# Altium schematic sheet USBConn.SchDoc
size A4; SheetNumber: 9; SheetTotal: 9
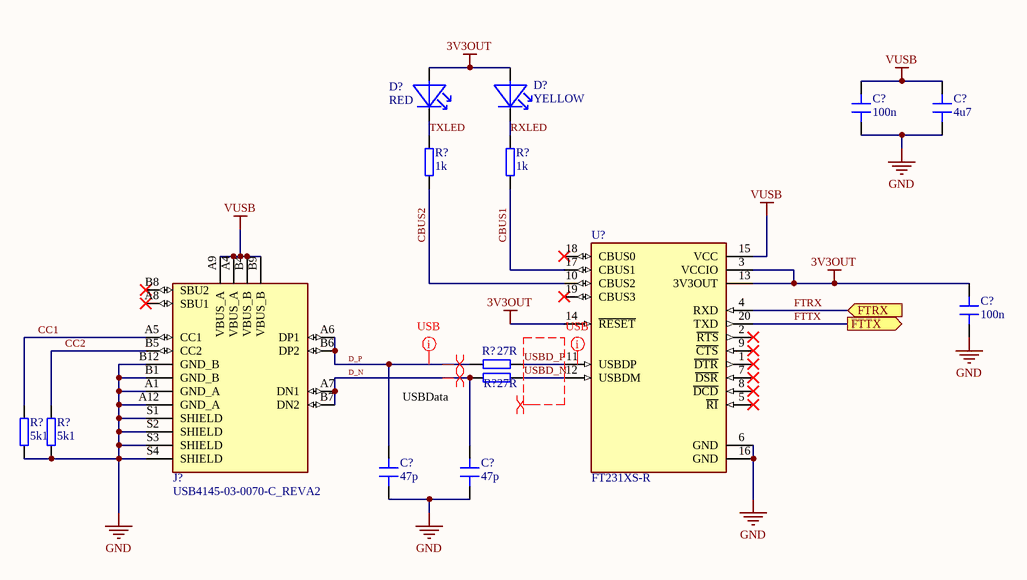
[diagram p0: USBConn.SchDoc]

## Parts
(Parts that share a designator on the sheet are numbered #1, #2 ... from top to bottom, then left to right.)
C?#1  100n
C?#2  4u7
C?#3  100n
C?#4  47p
C?#5  47p
D?#1  RED
D?#2  YELLOW
J?  USB4145-03-0070-C_REVA2  [GCT_USB4145-03-0070-C_REVA2]
R?#1  1k
R?#2  1k
R?#3  27R
R?#4  27R
R?#5  5k1
R?#6  5k1
U?  FT231XS-R  [SOP63P599X175-20N]

## Ports
FTRX (in), FTTX (out)

## Nets
3V3OUT: C?#3.2 D?#1.1 D?#2.1 U?.3(VCCIO) U?.13(3V3OUT) U?.14(~{RESET})
GND: C?#1.1 C?#2.1 C?#3.1 C?#4.1 C?#5.1 J?.A1(GND_A) J?.A12(GND_A) J?.B1(GND_B) J?.B12(GND_B) J?.S1(SHIELD) J?.S2(SHIELD) J?.S3(SHIELD) J?.S4(SHIELD) R?#5.1 R?#6.1 U?.6(GND) U?.16(GND)
VUSB: C?#1.2 C?#2.2 J?.A4(VBUS_A) J?.A9(VBUS_A) J?.B4(VBUS_B) J?.B9(VBUS_B) U?.15(VCC)
CBUS1: R?#2.1 U?.17(CBUS1)
CBUS2: R?#1.1 U?.10(CBUS2)
CC1: J?.A5(CC1) R?#5.2
CC2: J?.B5(CC2) R?#6.2
D_N: C?#5.2 J?.A7(DN1) J?.B7(DN2) R?#4.1
D_P: C?#4.2 J?.A6(DP1) J?.B6(DP2) R?#3.1
FTRX: U?.4(RXD) ; port FTRX
FTTX: U?.20(TXD) ; port FTTX
RXLED: D?#2.2 R?#2.2
TXLED: D?#1.2 R?#1.2
USBD_N: R?#4.2 U?.12(USBDM)
USBD_P: R?#3.2 U?.11(USBDP)

Not connected (* = marked no-connect by the designer): J? A8(SBU1)* B8(SBU2)*; U? 1(~{DTR})* 2(~{RTS})* 5(~{RI})* 7(~{DSR})* 8(~{DCD})* 9(~{CTS})* 18(CBUS0)* 19(CBUS3)*

## Layout directives
differential pair: D_N, D_P, USBD_N, USBD_P
mark named USB: (no net found under the mark), D_P

## Notes on the sheet
- (near R?#4) USBData

## Library data of the parts
C?#1-C?#5 = Capacitor: Value: *; HelpURL: *; MPN: *; Supplier: *; SupplierPartNumber: *
D?#1 D?#2 = LED: Value: *; HelpURL: *; MPN: *; Supplier: *; SupplierPartNumber: *
J? = USB4145-03-0070-C_REVA2: Type C USB 2.0 Connector; MF: Global Connector Technology; Availability: In Stock; Value: *; Check_prices: https://www.snapeda.com/parts/USB4145-03-0070-C/Global+Connector+Technology/view-part/?ref=eda; Package: None; Price: None; MP: USB4145-03-0070-C; SnapEDA_Link: https://www.snapeda.com/parts/USB4145-03-0070-C/Global+Connector+Technology/view-part/?ref=snap; Purchase-URL: https://pricing.snapeda.com/search/part/USB4145-03-0070-C/?ref=eda
R?#1-R?#6 = Resistor: Value: *; HelpURL: *; MPN: *; Supplier: *; SupplierPartNumber: *
U? = FT231XS-R: USB Bridge, USB to UART USB 2.0 UART Interface 20-SSOP; MF: FTDI,; Package: SSOP-20 FTDI; Price: None; Check_prices: https://www.snapeda.com/parts/FT231XS-R/FTDI%252C+Future+Technology+Devices+International+Ltd/view-part/?ref=eda; Value: *; SnapEDA_Link: https://www.snapeda.com/parts/FT231XS-R/FTDI%252C+Future+Technology+Devices+International+Ltd/view-part/?ref=snap; MP: FT231XS-R; Availability: In Stock; Purchase-URL: https://pricing.snapeda.com/search?q=FT231XS-R&ref=eda